# Altium schematic sheet MCU.SchDoc
size A3
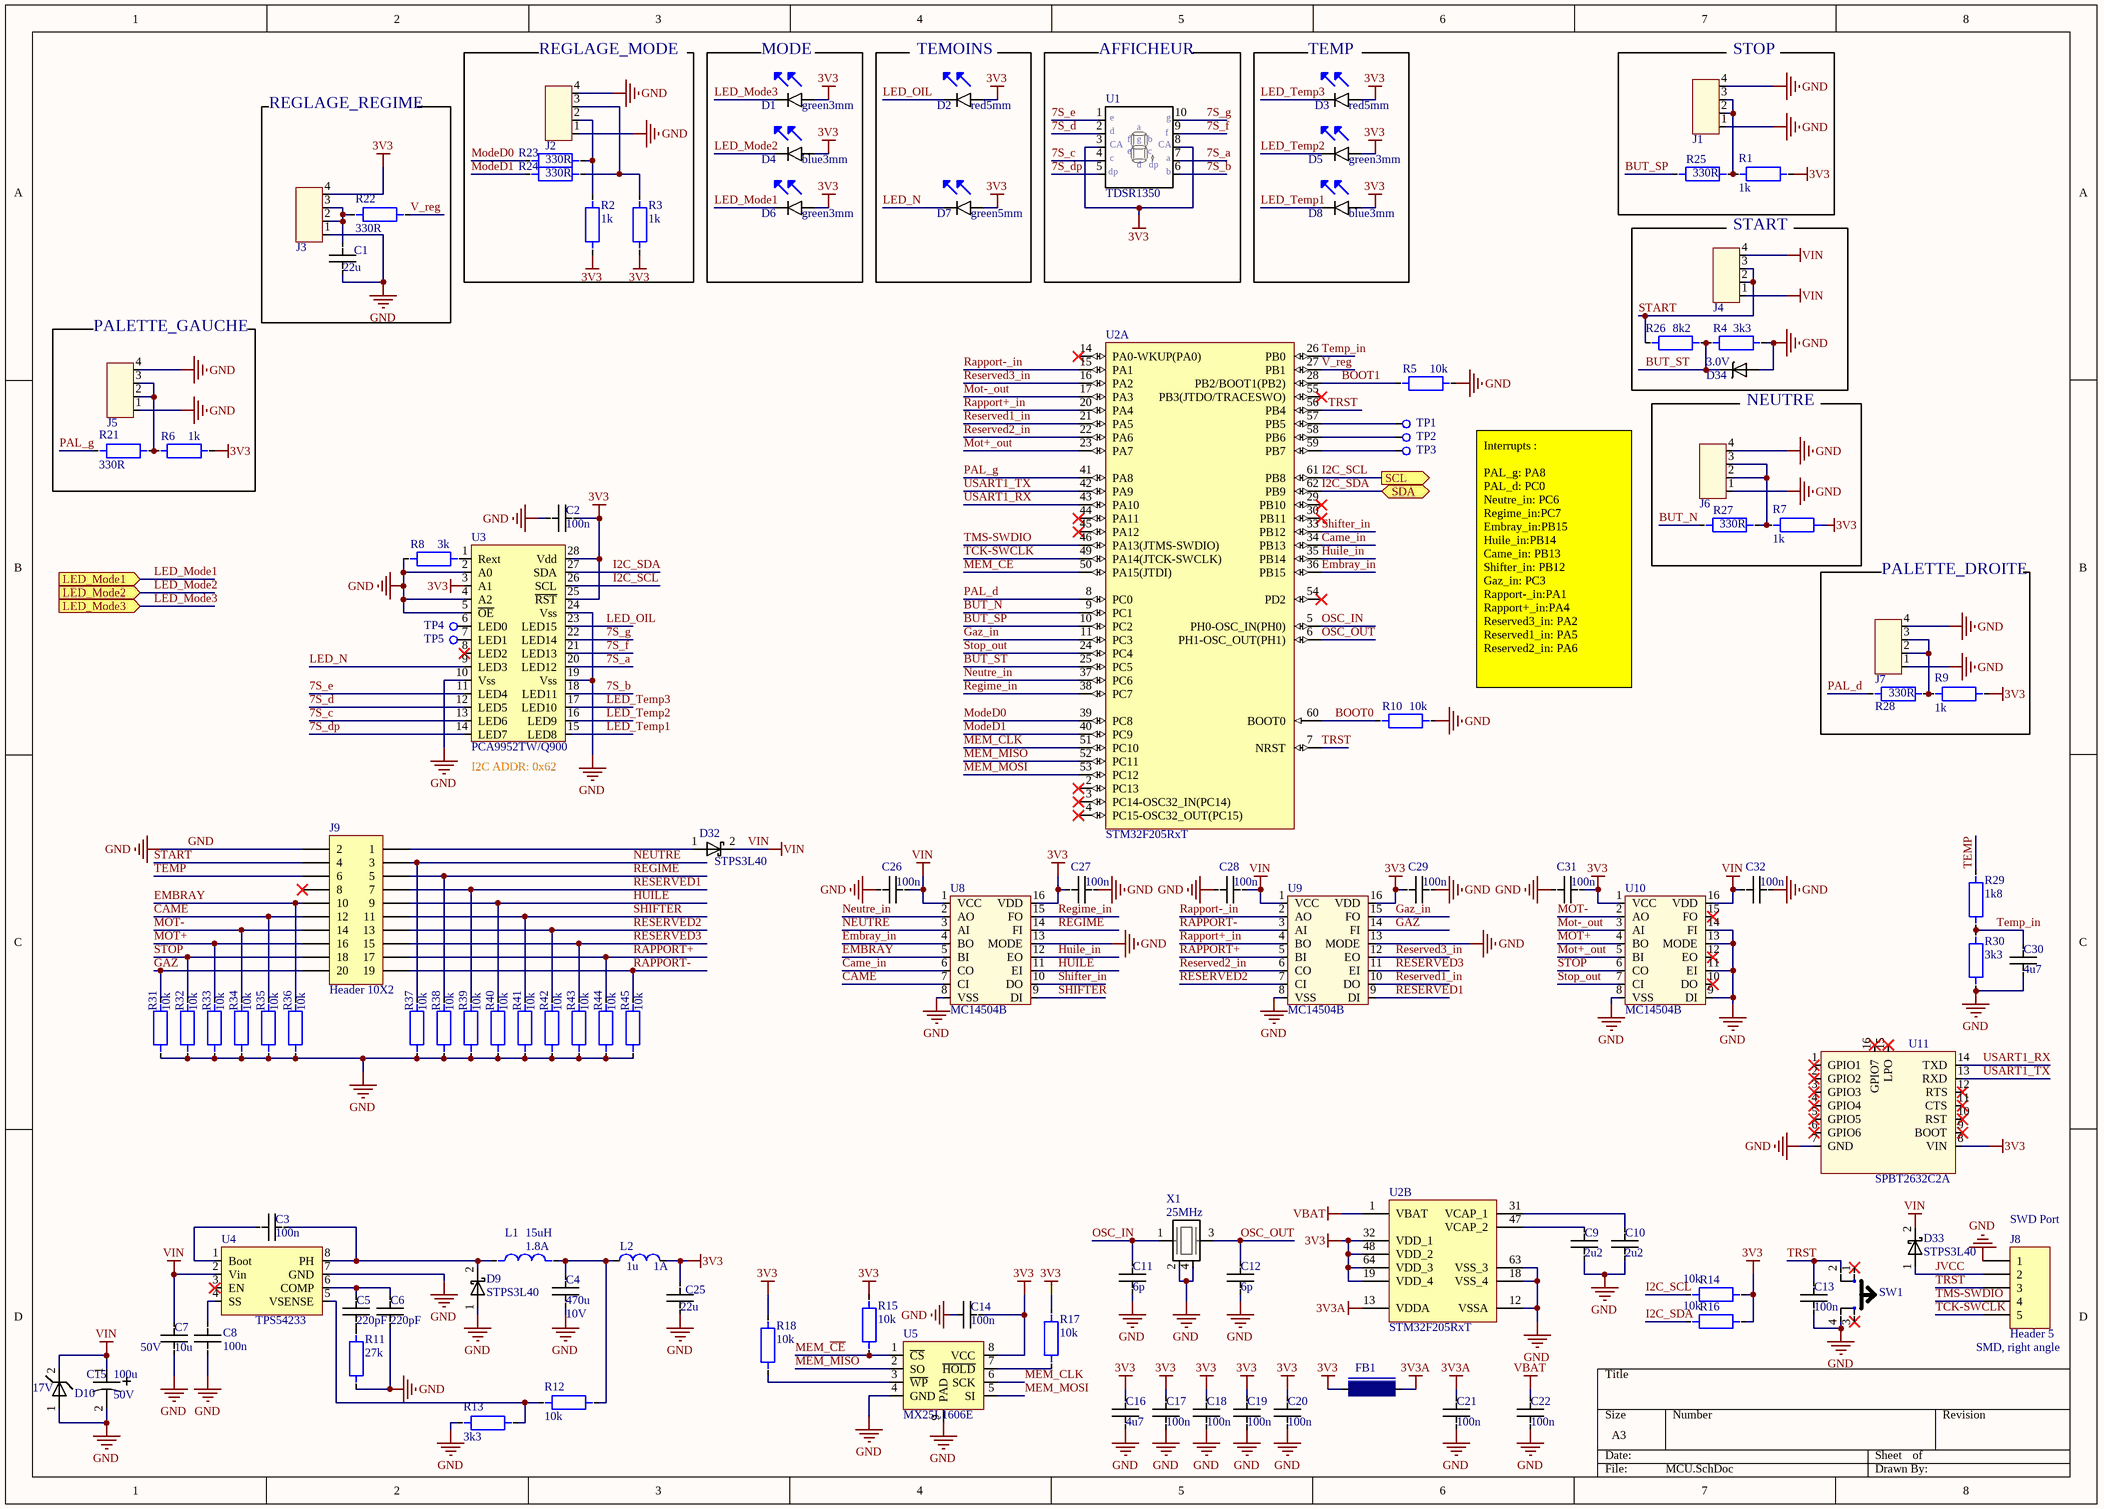
[diagram p0: MCU.SchDoc]

## Parts
C1  22u  [0805_]
C2  100n  [0402_]
C3  100n  [0402_]
C4  value 470u  Voltage: 10V  [2917]  (hidden comment: C)
C5  value 220pF  [0402_]  (hidden comment: C)
C6  value 220pF  [0402_]  (hidden comment: C)
C7  Rated voltage: 50V  [1206_]  (hidden comment: 10u)
C8  100n  [0402_]
C9  2u2  [0402_]
C10  2u2  [0402_]
C11  6p  [0402_]
C12  6p  [0402_]
C13  100n  [0402_]
C14  100n  [0402_]
C15  value 100u  Rated voltage: 50V  [C_pol8x12mm]  (hidden comment: C_pol)
C16  4u7  [0402_]
C17  100n  [0402_]
C18  100n  [0402_]
C19  100n  [0402_]
C20  100n  [0402_]
C21  100n  [0402_]
C22  100n  [0402_]
C25  22u  [0805_]
C26  100n  [0402_]
C27  100n  [0402_]
C28  100n  [0402_]
C29  100n  [0402_]
C30  4u7  [0402_]
C31  100n  [0402_]
C32  100n  [0402_]
D1  color_diam: green3mm  [LED3MM_GREEN]  (hidden comment: led)
D2  color_diam: red5mm  [LED5MM_RED]  (hidden comment: led)
D3  color_diam: red5mm  [LED5MM_RED]  (hidden comment: led)
D4  color_diam: blue3mm  [LED3MM_BLUE]  (hidden comment: led)
D5  color_diam: green3mm  [LED3MM_GREEN]  (hidden comment: led)
D6  color_diam: green3mm  [LED3MM_GREEN]  (hidden comment: led)
D7  color_diam: green5mm  [LED5MM_GREEN]  (hidden comment: led)
D8  color_diam: blue3mm  [LED3MM_BLUE]  (hidden comment: led)
D9  STPS3L40  [SMB_FLAT]
D10  Vz: 17V  [1N5354]  (hidden comment: Zener)
D32  STPS3L40  [SMB_FLAT]
D33  STPS3L40  [SMB_FLAT]
D34  Vz: 3.0V  [SOD323]  (hidden comment: BZX384-C3V0)
FB1  FB  [0402_]  (value not drawn)
J1  MOLEX_embase_4_voies  [MOLEX53047-0410]  (value not drawn)
J2  MOLEX_embase_4_voies  [MOLEX53047-0410]  (value not drawn)
J3  MOLEX_embase_4_voies  [MOLEX53047-0410]  (value not drawn)
J4  MOLEX_embase_4_voies  [MOLEX53047-0410]  (value not drawn)
J5  MOLEX_embase_4_voies  [MOLEX53047-0410]  (value not drawn)
J6  MOLEX_embase_4_voies  [MOLEX53047-0410]  (value not drawn)
J7  MOLEX_embase_4_voies  [MOLEX53047-0410]  (value not drawn)
J8  Header 5  value SWD Port  status: SMD, right angle  [HDR1X5]
J9  Header 10X2  [header2x10]
L1  value 15uH  Current: 1.8A  [SRN6028]  (hidden comment: L)
L2  value 1u  current: 1A  [0805_]  (hidden comment: Inductor)
R1  1k  [0402_]
R2  1k  [0402_]
R3  1k  [0402_]
R4  3k3  [0402_]
R5  10k  [0402_]
R6  1k  [0402_]
R7  1k  [0402_]
R8  3k  [0402_]
R9  1k  [0402_]
R10  10k  [0402_]
R11  27k  [0402_]
R12  10k  [0402_]
R13  3k3  [0402_]
R14  10k  [0402_]
R15  10k  [0402_]
R16  10k  [0402_]
R17  10k  [0402_]
R18  10k  [0402_]
R21  330R  [0402_]
R22  330R  [0402_]
R23  330R  [0402_]
R24  330R  [0402_]
R25  330R  [0402_]
R26  8k2  [0402_]
R27  330R  [0402_]
R28  330R  [0402_]
R29  1k8  [0402_]
R30  3k3  [0402_]
R31  10k  [0402_]
R32  10k  [0402_]
R33  10k  [0402_]
R34  10k  [0402_]
R35  10k  [0402_]
R36  10k  [0402_]
R37  10k  [0402_]
R38  10k  [0402_]
R39  10k  [0402_]
R40  10k  [0402_]
R41  10k  [0402_]
R42  10k  [0402_]
R43  10k  [0402_]
R44  10k  [0402_]
R45  10k  [0402_]
SW1  switch  [microswitch_PTS810]  (value not drawn)
TP1  TP  [TP_PogoPin]  (value not drawn)  (no BOM)
TP2  TP  [TP_PogoPin]  (value not drawn)  (no BOM)
TP3  TP  [TP_PogoPin]  (value not drawn)  (no BOM)
TP4  TP  [TP_PogoPin]  (value not drawn)  (no BOM)
TP5  TP  [TP_PogoPin]  (value not drawn)  (no BOM)
U1  TDSR1350  [TDSR1350]
U2  STM32F205RxT  [LQFP64]  (parts A,B of 2)
U3  PCA9952TW/Q900  [HTSSOP28]
U4  TPS54233  [soic8]
U5  MX25L1606E  [USON_8L]
U8  MC14504B  [SOIC16]
U9  MC14504B  [SOIC16]
U10  MC14504B  [SOIC16]
U11  SPBT2632C2A  [SPBT2632C2A]
X1  value 25MHz  [FA_128]  (hidden comment: QUARTZ)

## Ports
LED_Mode1 (in), LED_Mode2 (in), LED_Mode3 (in), SCL (out), SDA (bidir)

## Nets
3V3: C2.1 C14.1 C16.1 C17.1 C18.1 C19.1 C20.1 C25.1 C27.1 C29.1 C31.2 D1.1 D2.1 D3.1 D4.1 D5.1 D6.1 D7.1 D8.1 FB1.1 J3.4 L2.2 R1.2 R2.2 R3.2 R6.1 R7.2 R9.2 R14.1 R15.1 R16.1 R17.1 R18.1 U1.3 U1.8 U2.19(VDD_4) U2.32(VDD_1) U2.48(VDD_2) U2.64(VDD_3) U3.3(A1) U3.25(~{RST}) U3.28(Vdd) U5.8(VCC) U8.16(VDD) U9.16(VDD) U10.1(VCC) U11.8(VIN)
3V3A: C21.1 FB1.2 U2.13(VDDA)
GND: C1.2 C2.2 C4.2 C6.2 C7.1 C8.2 C9.1 C10.1 C11.1 C12.1 C13.2 C14.2 C15.2 C16.2 C17.2 C18.2 C19.2 C20.2 C21.2 C22.2 C25.2 C26.1 C27.2 C28.1 C29.2 C30.2 C31.1 C32.2 D9.1(A) D10.1 D34.1 J1.1 J1.4 J2.1 J2.4 J3.1 J5.1 J5.4 J6.1 J6.4 J7.1 J7.4 J8.1 J9.2 R4.1 R5.2 R8.1 R10.2 R11.2 R13.1 R30.2 R31.1 R32.1 R33.1 R34.1 R35.1 R36.1 R37.1 R38.1 R39.1 R40.1 R41.1 R42.1 R43.1 R44.1 R45.1 SW1.4 U2.12(VSSA) U2.18(VSS_4) U2.63(VSS_3) U3.2(A0) U3.4(A2) U3.5(~{OE}) U3.10(Vss) U3.19(Vss) U3.24(Vss) U4.7(GND) U5.4(GND) U5.9(PAD) U8.8(VSS) U8.13(MODE) U9.8(VSS) U9.13(MODE) U10.8(VSS) U10.9(DI) U10.11(EI) U10.13(MODE) U10.14(FI) U11.7(GND) X1.2 X1.4
VBAT: C22.1 U2.1(VBAT)
VIN: C7.2 C15.1 C26.2 C28.2 C32.1 D10.2 D32.2(K) D33.2(K) J4.1 J4.4 U4.2(Vin) U8.1(VCC) U9.1(VCC) U10.16(VDD)
7S_a: U1.7 U3.20(LED12)
7S_b: U1.6 U3.18(LED11)
7S_c: U1.4 U3.13(LED6)
7S_d: U1.2 U3.12(LED5)
7S_dp: U1.5 U3.14(LED7)
7S_e: U1.1 U3.11(LED4)
7S_f: U1.9 U3.21(LED13)
7S_g: U1.10 U3.22(LED14)
BOOT0: R10.1 U2.60(BOOT0)
BOOT1: R5.1 U2.28(PB2/BOOT1(PB2))
BUT_N: R27.2 U2.9(PC1)
BUT_SP: R25.2 U2.10(PC2)
BUT_ST: D34.2 R4.2 R26.1 U2.25(PC5)
CAME: J9.12 R35.2 U8.7(CI)
Came_in: U2.34(PB13) U8.6(CO)
EMBRAY: J9.10 R36.2 U8.5(BI)
Embray_in: U2.36(PB15) U8.4(BO)
GAZ: J9.20 R31.2 U9.14(FI)
Gaz_in: U2.11(PC3) U9.15(FO)
HUILE: J9.9 R40.2 U8.11(EI)
Huile_in: U2.35(PB14) U8.12(EO)
I2C_SCL: R14.2 U2.61(PB8) U3.26(SCL) ; port SCL
I2C_SDA: R16.2 U2.62(PB9) U3.27(SDA) ; port SDA
JVCC: D33.1(A) J8.2
LED_Mode1: D6.2 ; port LED_Mode1
LED_Mode2: D4.2 ; port LED_Mode2
LED_Mode3: D1.2 ; port LED_Mode3
LED_N: D7.2 U3.9(LED3)
LED_OIL: D2.2 U3.23(LED15)
LED_Temp1: D8.2 U3.15(LED8)
LED_Temp2: D5.2 U3.16(LED9)
LED_Temp3: D3.2 U3.17(LED10)
MEM_~{CE}: R15.2 U2.50(PA15(JTDI)) U5.1(~{CS})
MEM_CLK: U2.51(PC10) U5.6(SCK)
MEM_MISO: U2.52(PC11) U5.2(SO)
MEM_MOSI: U2.53(PC12) U5.5(SI)
ModeD0: R23.2 U2.39(PC8)
ModeD1: R24.2 U2.40(PC9)
MOT+: J9.16 R33.2 U10.4(BO)
Mot+_out: U2.23(PA7) U10.5(BI)
MOT-: J9.14 R34.2 U10.2(AO)
Mot-_out: U2.17(PA3) U10.3(AI)
NEUTRE: J9.3 R37.2 U8.3(AI)
Neutre_in: U2.37(PC6) U8.2(AO)
OSC_IN: C11.2 U2.5(PH0-OSC_IN(PH0)) X1.1
OSC_OUT: C12.2 U2.6(PH1-OSC_OUT(PH1)) X1.3
PAL_d: R28.2 U2.8(PC0)
PAL_g: R21.2 U2.41(PA8)
RAPPORT+: J9.17 R44.2 U9.5(BI)
Rapport+_in: U2.20(PA4) U9.4(BO)
RAPPORT-: J9.19 R45.2 U9.3(AI)
Rapport-_in: U2.15(PA1) U9.2(AO)
REGIME: J9.5 R38.2 U8.14(FI)
Regime_in: U2.38(PC7) U8.15(FO)
RESERVED1: J9.7 R39.2 U9.9(DI)
Reserved1_in: U2.21(PA5) U9.10(DO)
RESERVED2: J9.13 R42.2 U9.7(CI)
Reserved2_in: U2.22(PA6) U9.6(CO)
RESERVED3: J9.15 R43.2 U9.11(EI)
Reserved3_in: U2.16(PA2) U9.12(EO)
SHIFTER: J9.11 R41.2 U8.9(DI)
Shifter_in: U2.33(PB12) U8.10(DO)
START: J4.2 J4.3 J9.4 R26.2
STOP: J9.18 R32.2 U10.6(CO)
Stop_out: U2.24(PC4) U10.7(CI)
TCK-SWCLK: J8.5 U2.49(PA14(JTCK-SWCLK))
TEMP: J9.6 R29.1
Temp_in: C30.1 R29.2 R30.1 U2.26(PB0)
TMS-SWDIO: J8.4 U2.46(PA13(JTMS-SWDIO))
TRST: C13.1 J8.3 SW1.2 U2.7(NRST) U2.56(PB4)
USART1_RX: U2.43(PA10) U11.14(TXD)
USART1_TX: U2.42(PA9) U11.13(RXD)
V_reg: R22.1 U2.27(PB1)
NetC1_1: C1.1 J3.2 J3.3 R22.2
NetC3_1: C3.1 D9.2(K) L1.1 U4.8(PH)
NetC3_2: C3.2 U4.1(Boot)
NetC4_1: C4.1 L1.2 L2.1 R12.2
NetC5_1: C5.1 C6.1 U4.6(COMP)
NetC5_2: C5.2 R11.1
NetC8_1: C8.1 U4.4(SS)
NetC9_2: C9.2 U2.47(VCAP_2)
NetC10_2: C10.2 U2.31(VCAP_1)
NetD32_1: D32.1(A) J9.1
NetJ1_2: J1.2 J1.3 R1.1 R25.1
NetJ2_2: J2.2 R2.1 R23.1
NetJ2_3: J2.3 R3.1 R24.1
NetJ5_2: J5.2 J5.3 R6.2 R21.1
NetJ6_2: J6.2 J6.3 R7.1 R27.1
NetJ7_2: J7.2 J7.3 R9.1 R28.1
NetR8_2: R8.2 U3.1(Rext)
NetR12_1: R12.1 R13.2 U4.5(VSENSE)
NetR17_2: R17.2 U5.7(~{HOLD})
NetR18_2: R18.2 U5.3(~{WP})
NetTP1_1: TP1.1 U2.57(PB5)
NetTP2_1: TP2.1 U2.58(PB6)
NetTP3_1: TP3.1 U2.59(PB7)
NetTP4_1: TP4.1 U3.6(LED0)
NetTP5_1: TP5.1 U3.7(LED1)

Not connected (* = marked no-connect by the designer): J9 8*; SW1 1* 3*; U2 2(PC13)* 3(PC14-OSC32_IN(PC14))* 4(PC15-OSC32_OUT(PC15))* 14(PA0-WKUP(PA0))* 29(PB10)* 30(PB11)* 44(PA11)* 45(PA12)* 54(PD2)* 55(PB3(JTDO/TRACESWO))*; U3 8(LED2)*; U4 3(EN)*; U10 10(DO)* 12(EO)* 15(FO)*; U11 1(GPIO1)* 2(GPIO2)* 3(GPIO3)* 4(GPIO4)* 5(GPIO5)* 6(GPIO6)* 9(BOOT)* 10(RST)* 11(CTS)* 12(RTS)* 15(LPO)* 16(GPIO7)*

## Notes on the sheet
- REGLAGE_REGIME
- (near J2) REGLAGE_MODE
- (near D1) MODE
- (near D2) TEMOINS
- AFFICHEUR
- (near D3) TEMP
- (near J1) STOP
- (near J4) START
- (near J5) PALETTE_GAUCHE
- (near D34) NEUTRE
- PALETTE_DROITE
- Interrupts :
  PAL_g: PA8
  PAL_d: PC0
  Neutre_in: PC6
  Regime_in:PC7
  Embray_in:PB15
  Huile_in:PB14
  Came_in: PB13
  Shifter_in: PB12
  Gaz_in: PC3
  Rapport-_in:PA1
  Rapport+_in:PA4
  Reserved3_in: PA2
  Reserved1_in: PA5
  Reserved2_in: PA6
- (near U3) I2C ADDR: 0x62
- (in symbol TDSR1350) e; g; a; d; f; b; CA; c; dp

## Library data of the parts
C1 C25 = C: Manufacturer PartNum: GRM21BR61A226ME51L; Manufacturer: Murata; Rated voltage: 10V; value: 22u; Digikey ref: 490-10511-1-ND
C2 C3 C8 C13 C14 C17-C22 C26-C29 C31 C32 = C: Manufacturer PartNum: C1005X5R1E104K050BC; Manufacturer: TDK Corp; value: 100n; Digikey ref: 445-4964-1-ND
C4 = C: Manufacturer PartNum: T495X477K010ATE100; Manufacturer: Kemet; Digikey ref: 399-10524-1-ND
C5 C6 = C: Manufacturer PartNum: CL05B221KB5NNNC; Manufacturer: Samsung; Digikey ref: 1276-1531-1-ND
C7 = C: Manufacturer PartNum: CL31A106KBHNNNE; Manufacturer: Samsung; value: 10u; Digikey ref: 1276-2876-1-ND
C9 C10 = C: Manufacturer PartNum: GRM155R61A225KE95D; Manufacturer: Murata; voltage: 10V; value: 2u2; Digikey ref: 490-10451-1-ND
C11 C12 = C: Manufacturer: Samsung; Manufacturer PartNum: CL05C060DB5NCNC; value: 6p; Digikey ref: 1276-1608-1-ND
C15 = C_pol: Manufacturer: Nichicon; Manufacturer PartNum: UVR1H101MPD1TD; Digikey ref: 493-5916-1-ND
C16 C30 = C: Manufacturer: Murata; Manufacturer PartNum: GRM155R60J475ME47D; value: 4u7; Digikey ref: 490-5915-1-ND
D1 D5 D6 = led: Manufacturer: Kingbright; Manufacturer PartNum: WP710A10LZGCK; type: GREEN, 2.65V/2mA/1100mcd/3mm; Digikey ref: 754-1915-ND
D2 D3 = led: Manufacturer: Cree Inc; Manufacturer PartNum: C503B-RCN-CW0Z0AA1; type: RED, 2.1V/20mA/7500mcd/5mm; Digikey ref: C503B-RCN-CW0Z0AA1-ND
D4 D8 = led: Manufacturer: Wuerth; Manufacturer PartNum: 151033BS03000; type: BLUE, 2.8V/20mA/3800mcd/3mm; Digikey ref: 732-5011-ND
D7 = led: Manufacturer: Kingbright; Manufacturer PartNum: WP7113LZGCK; type: GREEN, 2.65V/2mA/3000mcd/5mm; Digikey ref: 754-1920-ND
D9 D32 D33 = STPS3L40: Manufacturer PartNum: STPS3L40UF; Manufacturer: STMicroelectronics; IFmax: 3A; Vf@IFmax: 0.5V; Digikey ref: 497-8036-1-ND
D10 = Zener: Manufacturer: ON Semi; Manufacturer PartNum: 1N5354BG; Digikey ref: 1N5354BGOS-ND
D34 = BZX384-C3V0: DIODE ZENER 3V 300MW SOD323; Manufacturer PartNum: BZX384-C3V0,115; Manufacturer: NXP; Digikey ref: 568-8043-1-ND
FB1 = FB: Manufacturer: Murata; Manufacturer PartNum: BLM15HG102SN1D; Digikey ref: 490-3999-1-ND
J1-J7 = MOLEX_embase_4_voies: 53047-0410 MOLEX; Manufacturer PartNum: 0530470410; Digikey ref: WM1733-ND; Manufacturer: Molex
J8 = Header 5: Header, 5-Pin; Manufacturer: TE Connectivity; Manufacturer PartNum: A9BAG-0502F; LatestRevisionDate: 17-Jul-2002; LatestRevisionNote: Re-released for DXP Platform.; Publisher: Altium Limited; Digikey ref: A9BAG-0502F-ND
J9 = Header 10X2: Header, 10-Pin, Dual row; Manufacturer: Harwin; Manufacturer PartNum: M20-9991046; LatestRevisionDate: 17-Jul-2002; LatestRevisionNote: Re-released for DXP Platform.; Publisher: Altium Limited
L1 = L: 15µH Unshielded Wirewound Inductor 1.8A 114 mOhm Max Nonstandard; Manufacturer PartNum: SRN6028-150M; Manufacturer: Bourns Inc; Digikey ref: SRN6028-150MCT-ND
L2 = Inductor: Manufacturer PartNum: BRC2012T1R0M; Manufacturer: Taiyo Yuden; Farnell ref: 1904336; Digikey ref: 587-2903-1-ND
R1-R3 R6 R7 R9 = R: Manufacturer PartNum: MCR01MRTF1001; Manufacturer: Rohm Semi; value: 1k; Digikey ref: RHM1.00KCDCT-ND
R4 R26 = R
  R4: value: 3k3
  R26: value: 8k2
R5 R10 R31-R45 = R: Manufacturer: Susumu; Manufacturer PartNum: RR0510P-103-D; value: 10k; Digikey ref: RR05P10.0KDCT-ND
R8 = R: Manufacturer PartNum: RC0402FR-073KL; Manufacturer: Yageo; value: 3k; Digikey ref: 311-3KLRCT-ND
R11 = R: Manufacturer PartNum: ERJ-2RKF2702X; Manufacturer: Panasonic; value: 27k; Digikey ref: P27.0KLCT-ND
R12 R14-R18 = R: Manufacturer PartNum: ERJ-2RKF1002X; Manufacturer: Panasonic; value: 10k; Digikey ref: P10.0KLCT-ND
R13 = R: Manufacturer PartNum: ERJ-2RKF3301X; Manufacturer: Panasonic; value: 3k3; Digikey ref: P3.30KLCT-ND
R21-R25 R27 R28 = R: Manufacturer PartNum: RC0402JR-07330RL; Manufacturer: Yageo; value: 330R; Digikey ref: 311-330JRCT-ND
R29 = R: Manufacturer PartNum: RC0402FR-071K8L; Manufacturer: Yageo; value: 1k8; Digikey ref: 311-1.80KLRCT-ND
R30 = R: Manufacturer PartNum: RC0402FR-073K3L; Manufacturer: Yageo; value: 3k3; Digikey ref: 311-3.30KLRCT-ND
SW1 = switch: Manufacturer: C&K; Manufacturer PartNum: PTS810 SJM 250 SMTR LFS; Digikey ref: CKN10502CT-ND
U1 = TDSR1350: Manufacturer: Vishay Semi; Digikey ref: TDSR1350-ND; Manufacturer PartNum: TDSR1350
U2 = STM32F205RxT: Manufacturer: ST Microelectronics; Manufacturer PartNum: STM32F205RCT6; Digikey ref: 497-11154-ND
U3 = PCA9952TW/Q900: Manufacturer: NXP; Manufacturer PartNum: PCA9952TW/Q900,118; Digikey ref: 568-10954-1-ND; Farnell ref: *; status: *
U4 = TPS54233: Buck Switching Regulator IC Positive Adjustable 0.8V 1 Output 2A 8-SOIC (0.154", 3.90mm Width); Manufacturer: Texas Instruments; Manufacturer PartNum: TPS54233DR; Digikey ref: 296-23902-1-ND
U5 = MX25L1606E: 16M-BIT [x 1 / x 2] CMOS SERIAL FLASH, 4KB Sector Erase; Manufacturer PartNum: MX25L1606EZUI-12G; Manufacturer: Macronix; Note1: Leave thermal pad floating; Digikey ref: 1092-1056-ND
U8-U10 = MC14504B: IC LEVEL SHIFTER HEX 16-SOIC; Manufacturer: On Semi; Manufacturer PartNum: MC14504BDG; Digikey ref: MC14504BDGOS-ND
U11 = SPBT2632C2A: Manufacturer: ST Microelectronics; Manufacturer PartNum: SPBT2632C2A.AT2; Digikey ref: 497-13189-ND; Farnell ref: *
X1 = QUARTZ: Manufacturer PartNum: 8Y-25.000MAAV-T; Manufacturer: TXC Corp.; Digikey ref: 887-2000-1-ND; Farnell ref: 1892193 (US)